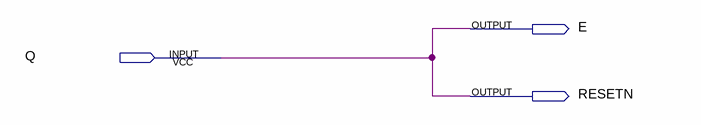
[diagram p0: schematic sheet]
// Quartus schematic OUTPUT_CTL.bdf as structural Verilog: 0 symbols, 3 pins
module OUTPUT_CTL (
  input  Q,
  output E,
  output RESETN
);


  assign E = Q;
  assign RESETN = Q;
endmodule
